# Altium project 24V Multiphase Buck.PrjPcb
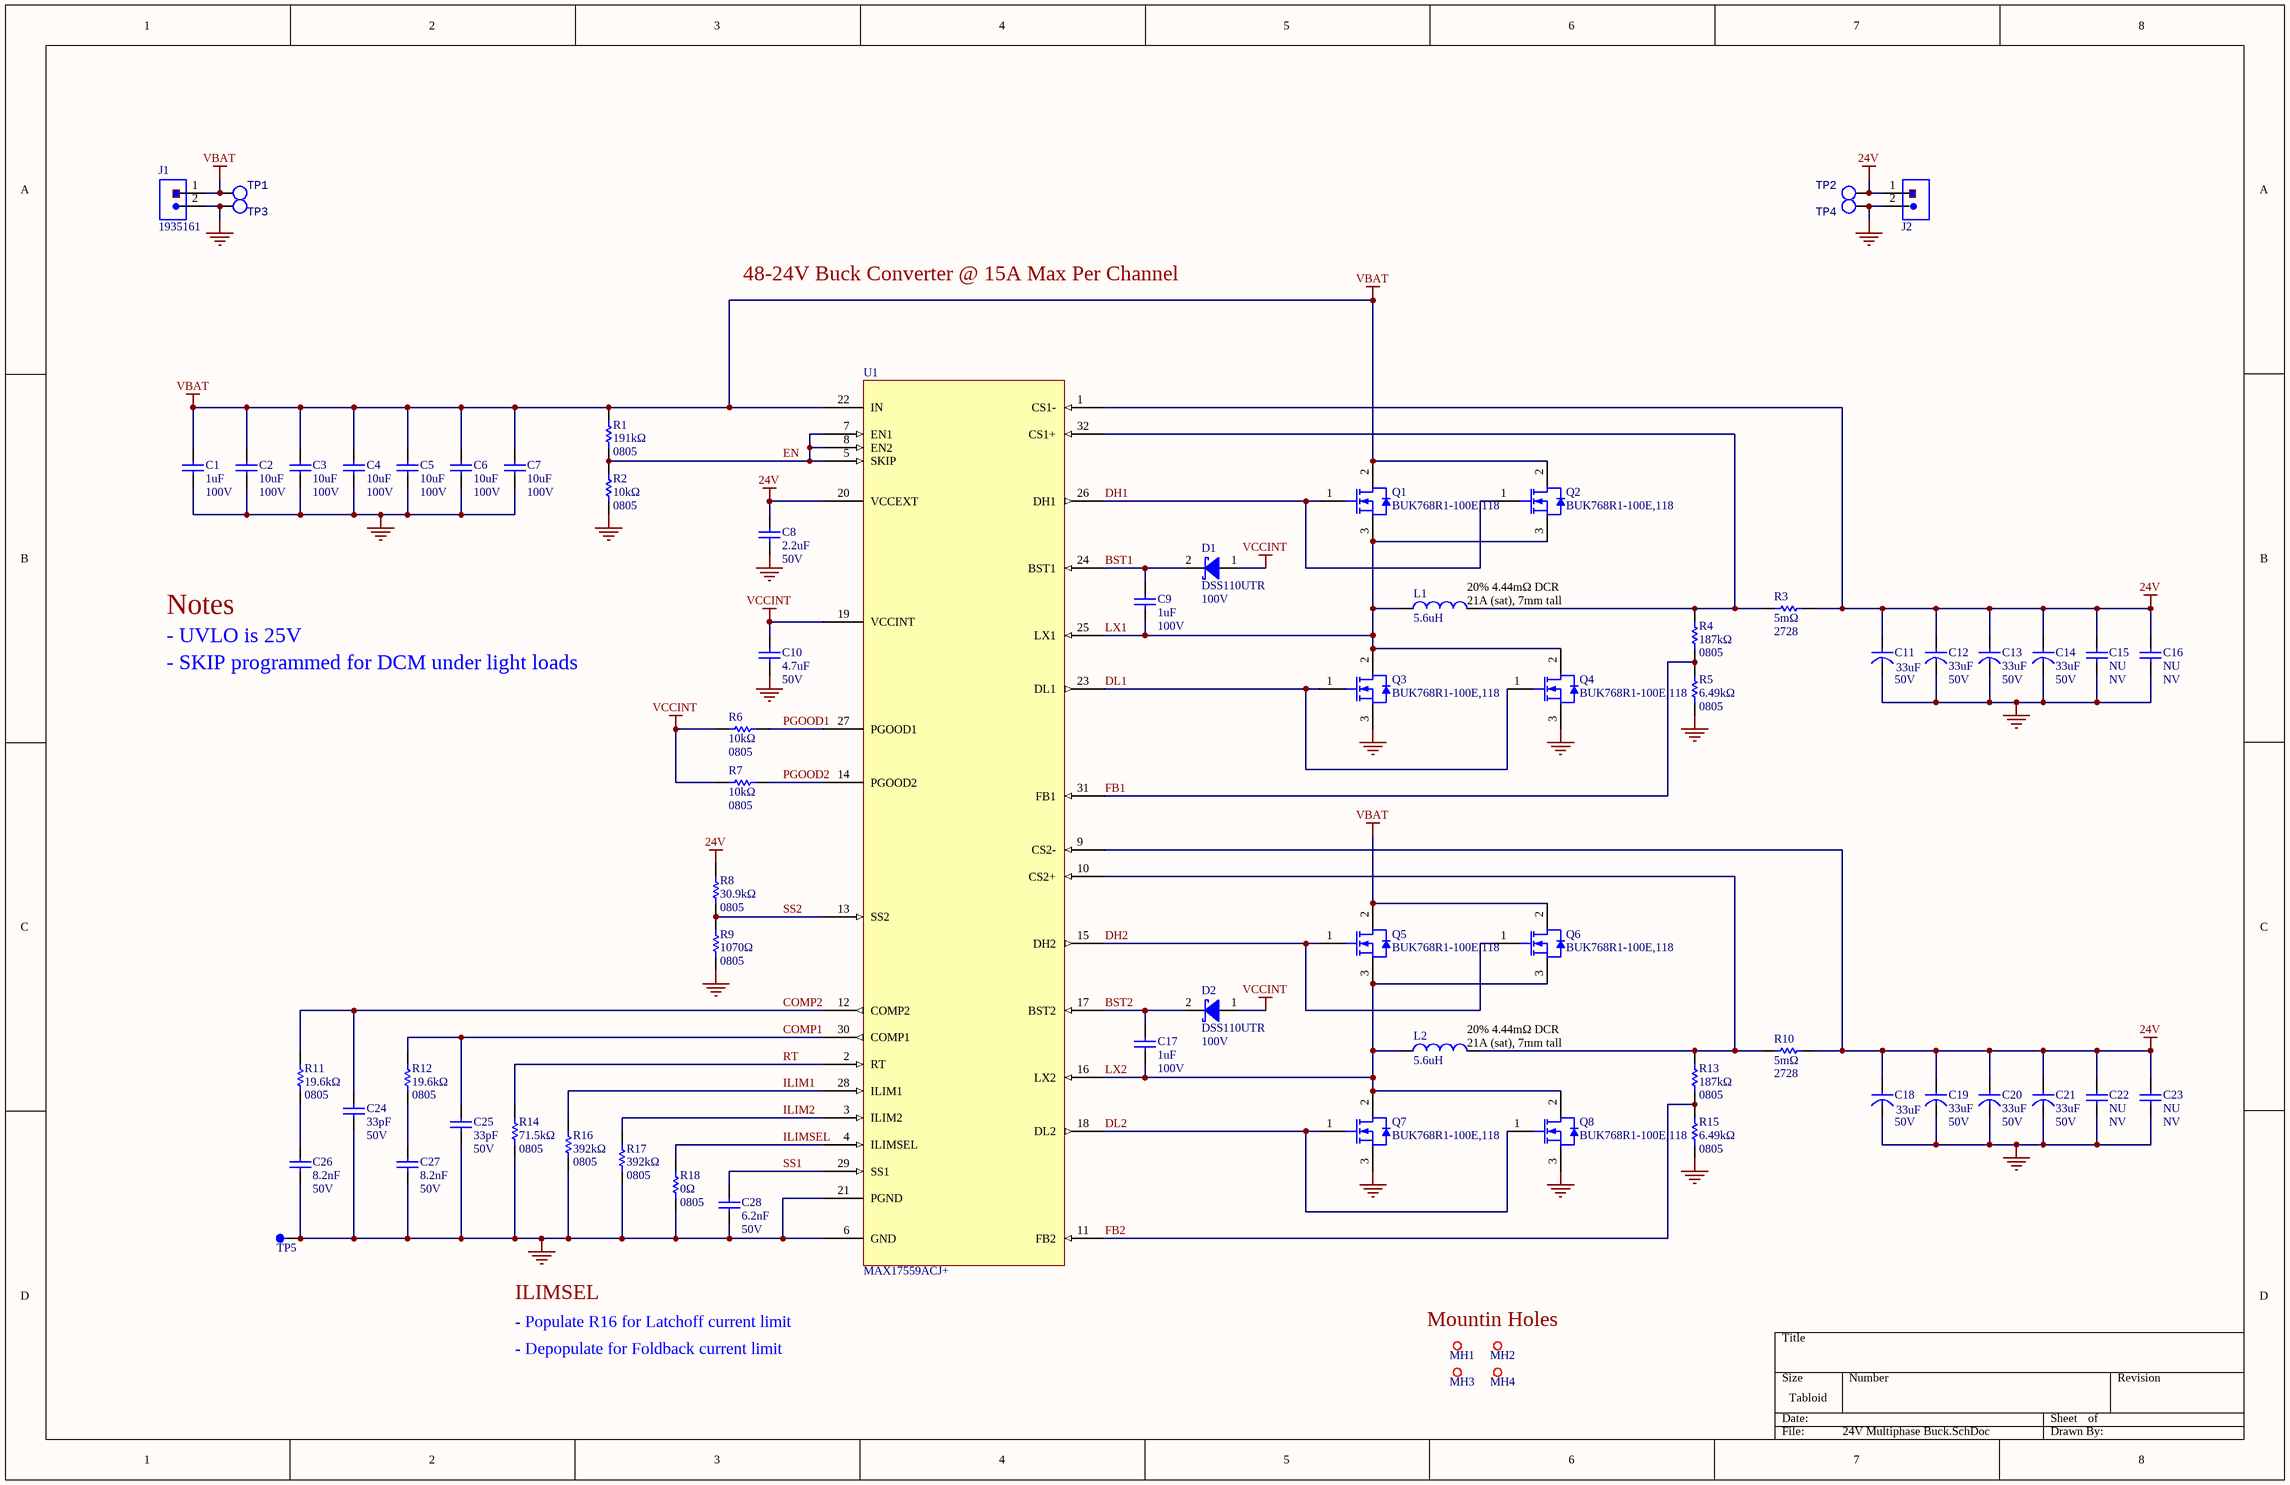
[diagram p0: 24V Multiphase Buck.SchDoc]
EMR_Address: 420 Downsview Pl, Waterloo, ON,  N2K3T9, Canada; EMR_Checked_By: T. Smouter; EMR_Copyright_Year: 2021; EMR_Customer: Internal; EMR_Drawn_By: T. Smouter; EMR_Project_Engineer: T. Smouter; EMR_Project_Title: Pipe Dream; EMR_Revision: 0.1
1 sheet, 70 parts. Net scope: global (net labels, ports and power ports of the same name join across sheets).
Board file: 24V Multiphase Buck.PcbDoc

## Sheet 24V Multiphase Buck.SchDoc
size Tabloid

### Parts
C1  value 1uF  Voltage: 100V  [C1206]  (hidden comment: Ceramic Cap)
C2  value 10uF  Voltage: 100V  [C2220]  (hidden comment: Ceramic Cap)
C3  value 10uF  Voltage: 100V  [C2220]  (hidden comment: Ceramic Cap)
C4  value 10uF  Voltage: 100V  [C2220]  (hidden comment: Ceramic Cap)
C5  value 10uF  Voltage: 100V  [C2220]  (hidden comment: Ceramic Cap)
C6  value 10uF  Voltage: 100V  [C2220]  (hidden comment: Ceramic Cap)
C7  value 10uF  Voltage: 100V  [C2220]  (hidden comment: Ceramic Cap)
C8  value 2.2uF  Voltage: 50V  [C0805]  (hidden comment: Ceramic Cap)
C9  value 1uF  Voltage: 100V  [C1206]  (hidden comment: Ceramic Cap)
C10  value 4.7uF  Voltage: 50V  [C0805]  (hidden comment: Ceramic Cap)
C11  value 33uF  Voltage: 50V  [CAPAE9983X105M]  (hidden comment: Electro Cap)
C12  value 33uF  Voltage: 50V  [CAPAE9983X105M]  (hidden comment: Electro Cap)
C13  value 33uF  Voltage: 50V  [CAPAE9983X105M]  (hidden comment: Electro Cap)
C14  value 33uF  Voltage: 50V  [CAPAE9983X105M]  (hidden comment: Electro Cap)
C15  value NU  Voltage: NV  [CAPC6153X67N]  (hidden comment: Ceramic Cap)
C16  value NU  Voltage: NV  [CAPC6153X67N]  (hidden comment: Ceramic Cap)
C17  value 1uF  Voltage: 100V  [C1206]  (hidden comment: Ceramic Cap)
C18  value 33uF  Voltage: 50V  [CAPAE9983X105M]  (hidden comment: Electro Cap)
C19  value 33uF  Voltage: 50V  [CAPAE9983X105M]  (hidden comment: Electro Cap)
C20  value 33uF  Voltage: 50V  [CAPAE9983X105M]  (hidden comment: Electro Cap)
C21  value 33uF  Voltage: 50V  [CAPAE9983X105M]  (hidden comment: Electro Cap)
C22  value NU  Voltage: NV  [CAPC6153X67N]  (hidden comment: Ceramic Cap)
C23  value NU  Voltage: NV  [CAPC6153X67N]  (hidden comment: Ceramic Cap)
C24  value 33pF  Voltage: 50V  [C0805]  (hidden comment: Ceramic Cap)
C25  value 33pF  Voltage: 50V  [C0805]  (hidden comment: Ceramic Cap)
C26  value 8.2nF  Voltage: 50V  [C0805]  (hidden comment: Ceramic Cap)
C27  value 8.2nF  Voltage: 50V  [C0805]  (hidden comment: Ceramic Cap)
C28  value 6.2nF  Voltage: 50V  [C0805]  (hidden comment: Ceramic Cap)
D1  Manufacturer Part Number: DSS110UTR  Vr: 100V  [SODFL360X110-2N]  (hidden comment: Schottky Diode)
D2  Manufacturer Part Number: DSS110UTR  Vr: 100V  [SODFL360X110-2N]  (hidden comment: Schottky Diode)
J1  1935161  [1935161]
J2  1935161  [1935161]  (value not drawn)
L1  value 5.6uH  [IHLP6767GZER5R6M11]  (hidden comment: Inductor)
L2  value 5.6uH  [IHLP6767GZER5R6M11]  (hidden comment: Inductor)
MH1  MOUNTING_HOLE_M3  [MOUNTING_HOLE_3mm]  (value not drawn)  (no BOM)
MH2  MOUNTING_HOLE_M3  [MOUNTING_HOLE_3mm]  (value not drawn)  (no BOM)
MH3  MOUNTING_HOLE_M3  [MOUNTING_HOLE_3mm]  (value not drawn)  (no BOM)
MH4  MOUNTING_HOLE_M3  [MOUNTING_HOLE_3mm]  (value not drawn)  (no BOM)
Q1  BUK768R1-100E,118  [DPAK254P1530X450-3N]
Q2  BUK768R1-100E,118  [DPAK254P1530X450-3N]
Q3  BUK768R1-100E,118  [DPAK254P1530X450-3N]
Q4  BUK768R1-100E,118  [DPAK254P1530X450-3N]
Q5  BUK768R1-100E,118  [DPAK254P1530X450-3N]
Q6  BUK768R1-100E,118  [DPAK254P1530X450-3N]
Q7  BUK768R1-100E,118  [DPAK254P1530X450-3N]
Q8  BUK768R1-100E,118  [DPAK254P1530X450-3N]
R1  value 191kΩ  Package/Footprint: 0805  [R0805]  (hidden comment: Resistor)
R2  value 10kΩ  Package/Footprint: 0805  [R0805]  (hidden comment: Resistor)
R3  value 5mΩ  Package/Footprint: 2728  [R2728]  (hidden comment: Resistor)
R4  value 187kΩ  Package/Footprint: 0805  [R0805]  (hidden comment: Resistor)
R5  value 6.49kΩ  Package/Footprint: 0805  [R0805]  (hidden comment: Resistor)
R6  value 10kΩ  Package/Footprint: 0805  [R0805]  (hidden comment: Resistor)
R7  value 10kΩ  Package/Footprint: 0805  [R0805]  (hidden comment: Resistor)
R8  value 30.9kΩ  Package/Footprint: 0805  [R0805]  (hidden comment: Resistor)
R9  value 1070Ω  Package/Footprint: 0805  [R0805]  (hidden comment: Resistor)
R10  value 5mΩ  Package/Footprint: 2728  [R2728]  (hidden comment: Resistor)
R11  value 19.6kΩ  Package/Footprint: 0805  [R0805]  (hidden comment: Resistor)
R12  value 19.6kΩ  Package/Footprint: 0805  [R0805]  (hidden comment: Resistor)
R13  value 187kΩ  Package/Footprint: 0805  [R0805]  (hidden comment: Resistor)
R14  value 71.5kΩ  Package/Footprint: 0805  [R0805]  (hidden comment: Resistor)
R15  value 6.49kΩ  Package/Footprint: 0805  [R0805]  (hidden comment: Resistor)
R16  value 392kΩ  Package/Footprint: 0805  [R0805]  (hidden comment: Resistor)
R17  value 392kΩ  Package/Footprint: 0805  [R0805]  (hidden comment: Resistor)
R18  value 0Ω  Package/Footprint: 0805  [R0805]  (hidden comment: Resistor)
TP1  TESTPOINT_LOOP  [TESTPOINT_LOOP]  (value not drawn)
TP2  TESTPOINT_LOOP  [TESTPOINT_LOOP]  (value not drawn)
TP3  TESTPOINT_LOOP  [TESTPOINT_LOOP]  (value not drawn)
TP4  TESTPOINT_LOOP  [TESTPOINT_LOOP]  (value not drawn)
TP5  EMR_TP  [TP1]  (value not drawn)
U1  MAX17559ACJ+  [CQFP80P900X900X120-32N]

### Nets
24V: C8.2 C11.1(+) C12.1(+) C13.1(+) C14.1(+) C15.2 C16.2 C18.1(+) C19.1(+) C20.1(+) C21.1(+) C22.2 C23.2 J2.1 R3.2 R8.2 R10.2 TP2.1 U1.1(CS1-) U1.9(CS2-) U1.20(VCCEXT)
GND: C1.1 C2.1 C3.1 C4.1 C5.1 C6.1 C7.1 C8.1 C10.1 C11.2(-) C12.2(-) C13.2(-) C14.2(-) C15.1 C16.1 C18.2(-) C19.2(-) C20.2(-) C21.2(-) C22.1 C23.1 C24.1 C25.1 C26.1 C27.1 C28.1 J1.2 J2.2 Q3.3(S) Q4.3(S) Q7.3(S) Q8.3(S) R2.1 R5.1 R9.1 R14.1 R15.1 R16.1 R17.1 R18.1 TP3.1 TP4.1 TP5.1(A) U1.6(GND) U1.21(PGND)
VBAT: C1.2 C2.2 C3.2 C4.2 C5.2 C6.2 C7.2 J1.1 Q1.2(D) Q2.2(D) Q5.2(D) Q6.2(D) R1.2 TP1.1 U1.22(IN)
VCCINT: C10.2 D1.1(A) D2.1(A) R6.1 R7.1 U1.19(VCCINT)
BST1: C9.2 D1.2(K) U1.24(BST1)
BST2: C17.2 D2.2(K) U1.17(BST2)
COMP1: C25.2 R12.2 U1.30(COMP1)
COMP2: C24.2 R11.2 U1.12(COMP2)
DH1: Q1.1(G) Q2.1(G) U1.26(DH1)
DH2: Q5.1(G) Q6.1(G) U1.15(DH2)
DL1: Q3.1(G) Q4.1(G) U1.23(DL1)
DL2: Q7.1(G) Q8.1(G) U1.18(DL2)
EN: R1.1 R2.2 U1.5(SKIP) U1.7(EN1) U1.8(EN2)
FB1: R4.1 R5.2 U1.31(FB1)
FB2: R13.1 R15.2 U1.11(FB2)
ILIM1: R16.2 U1.28(ILIM1)
ILIM2: R17.2 U1.3(ILIM2)
ILIMSEL: R18.2 U1.4(ILIMSEL)
LX1: C9.1 L1.1 Q1.3(S) Q2.3(S) Q3.2(D) Q4.2(D) U1.25(LX1)
LX2: C17.1 L2.1 Q5.3(S) Q6.3(S) Q7.2(D) Q8.2(D) U1.16(LX2)
PGOOD1: R6.2 U1.27(PGOOD1)
PGOOD2: R7.2 U1.14(PGOOD2)
RT: R14.2 U1.2(RT)
SS1: C28.2 U1.29(SS1)
SS2: R8.1 R9.2 U1.13(SS2)
NetC26_2: C26.2 R11.1
NetC27_2: C27.2 R12.1
NetL1_2: L1.2 R3.1 R4.2 U1.32(CS1+)
NetL2_2: L2.2 R10.1 R13.2 U1.10(CS2+)

### Notes on the sheet
- 48-24V Buck Converter @ 15A Max Per Channel
- Notes
- (near L1) 20% 4.44mΩ DCR
- (near L1) 21A (sat), 7mm tall
- - SKIP programmed for DCM under light loads
- - UVLO is 25V
- (near L2) 20% 4.44mΩ DCR
- (near L2) 21A (sat), 7mm tall
- ILIMSEL
- - Populate R16 for Latchoff current limit
- - Depopulate for Foldback current limit
- Mountin Holes

### Library data of the parts
C1 C9 C17 = CL31B105KCHNFNE: Manufacturer: Samsung Electro-Mechanics; Part Number: CL31B105KCHNFNE; Package: 1206; Supplier: Digi-Key; Supplier Part Number: 1276-3094-2-ND; Voltage Rating: 100V; Capacitance: 1uF
C2-C7 = 22201C106KAT2A: Manufacturer: KYOCERA AVX; Part Number: 22201C106KAT2A; Package: 2220; Supplier: Digi-Key; Supplier Part Number: 478-12492-1-ND; Voltage Rating: 100V; Capacitance: 10uF
C8 = CL21A225KBFNNNE: Manufacturer: Samsung Electro-Mechanics; Part Number: CL21A225KBFNNNE; Package: 0805; Supplier: Digi-Key; Supplier Part Number: 1276-6702-1-ND; Voltage Rating: 50V; Capacitance: 2.2uF
C10 = GRM21BR61H475KE51L: Manufacturer: Murata Electronics; Part Number: GRM21BR61H475KE51L; Package: 0805; Supplier: Digi-Key; Supplier Part Number: 490-10751-1-ND; Voltage Rating: 50V; Capacitance: 4.7uF
C11-C14 C18-C21 = EEV-FC1H330P: Manufacturer: Panasonic Electronic Components; Part Number: EEV-FC1H330P; Package: Radial; Supplier: Digi-Key; Supplier Part Number: PCE3258CT-ND; Voltage Rating: 50V; Capacitance: 33uF
C15 C16 C22 C23 = KRM55WR71H336MH01K: Manufacturer: Murata Electronics; Part Number: KRM55WR71H336MH01K; Package: Stacked SMD; Supplier: Digi-Key; Supplier Part Number: 490-17695-1-ND; Voltage Rating: NV; Capacitance: NU
C24 C25 = C0805C330K5GAC7800: Manufacturer: KEMET; Part Number: C0805C330K5GAC7800; Package: 0805; Supplier: Digi-Key; Supplier Part Number: 339-C0805C330K5GAC7800CT-ND; Voltage Rating: 50V; Capacitance: 33pF
C26 C27 = CC0805KRX7R9BB822: Manufacturer: YAGEO; Part Number: CC0805KRX7R9BB822; Package: 0805; Supplier: Digi-Key; Supplier Part Number: 311-4331-1-ND; Voltage Rating: 50V; Capacitance: 8.2nF
C28 = GRM2195C1H622JA01D: Manufacturer: Murata Electronics; Part Number: GRM2195C1H622JA01D; Package: 0805; Supplier: Digi-Key; Supplier Part Number: 490-1637-1-ND; Voltage Rating: 50V; Capacitance: 6.2nF
D1 D2 = DSS110UTR: Part Number: DSS110UTR; Package: SOD-123F; Supplier: Digi-Key; Supplier Part Number: 1655-1931-1-ND; Vr (Max): 100V
J1 = 1935161: 2 Port Terminal; Manufacturer: Phoenix Contact; Part Number: 1935161; Mounting Type: TH; Supplier: Digi-Key; Supplier Part Number: 277-1667-ND
J2 = 1935161: Manufacturer: Phoenix Contact; Part Number: 1935161; Mounting Type: TH; Supplier: Digi-Key; Supplier Part Number: 277-1667-ND
L1 L2 = IHLP6767GZER5R6M11: Manufacturer: Vishay Dale; DCR: 4.44mΩ; Tolerance: 20%; Saturation Current: 21A; Part Number: IHLP6767GZER5R6M11; Inductance: 5.6uH; Supplier: Digi-Key; Supplier Part Number: 541-1283-1-ND
Q1-Q8 = BUK768R1-100E,118: Manufacturer: Nexperia USA Inc.; Type: N-CH; Vds: 100V; Vgs (Max): 20V; Id: 100A; Manufacturer Part Number: BUK768R1-100E,118; Part Number: BUK768R1-100E,118; Package: D2PAK; Supplier: Digi-Key; Supplier Part Number: 1727-1062-1-ND
R1 = RC0805FR-07191KL: Manufacturer: Yageo; Part Number: RC0805FR-07191KL; Supplier: Digi-Key; Supplier Part Number: 311-191KCRTR-ND; Resistance: 191kΩ; Package: 0805
R2 R6 R7 = RC0805JR-0710KL: Manufacturer: Yageo; Part Number: RC0805JR-0710KL; Supplier: Digi-Key; Supplier Part Number: 311-10KARTR-ND; Resistance: 10kΩ; Package: 0805
R3 R10 = CSSH2728FT5L00: Manufacturer: Yageo; Part Number: CSSH2728FT5L00; Supplier: Digi-Key; Supplier Part Number: CSSH2728FT5L00TR-ND; Resistance: 5mΩ; Package: 2728
R4 R13 = RT0805BRD07187KL: Manufacturer: Yageo; Part Number: RT0805BRD07187KL; Supplier: Digi-Key; Supplier Part Number: 13-RT0805BRD07187KLCT-ND; Resistance: 187kΩ; Package: 0805
R5 R15 = RC0805FR-076K49L: Manufacturer: Yageo; Part Number: RC0805FR-076K49L; Supplier: Digi-Key; Supplier Part Number: 311-6.49KCRTR-ND; Resistance: 6.49kΩ; Package: 0805
R8 = RMCF0805FT30K9: Manufacturer: Stackpole Electronics Inc; Part Number: RMCF0805FT30K9; Supplier: Digi-Key; Supplier Part Number: RMCF0805FT30K9CT-ND; Resistance: 30.9kΩ; Package: 0805
R9 = RC0805FR-071K07L: Manufacturer: Yageo; Part Number: RC0805FR-071K07L; Supplier: Digi-Key; Supplier Part Number: 311-1.07KCRCT-ND; Resistance: 1070Ω; Package: 0805
R11 R12 = AC0805FR-0719K6L: Manufacturer: Yageo; Part Number: AC0805FR-0719K6L; Supplier: Digi-Key; Supplier Part Number: YAG5355TR-ND; Resistance: 19.6kΩ; Package: 0805
R14 = RC0805FR-0771K5L: Manufacturer: Yageo; Part Number: RC0805FR-0771K5L; Supplier: Digi-Key; Supplier Part Number: 311-71.5KCRCT-ND; Resistance: 71.5kΩ; Package: 0805
R16 R17 = RC0805FR-07392KL: Manufacturer: Yageo; Part Number: RC0805FR-07392KL; Supplier: Digi-Key; Supplier Part Number: 311-392KCRCT-ND; Resistance: 392kΩ; Package: 0805
R18 = RC0805JR-070RL: Manufacturer: Yageo; Part Number: RC0805JR-070RL; Supplier: Digi-Key; Supplier Part Number: 311-0.0ARCT-ND; Resistance: 0Ω; Package: 0805
TP1-TP4 = TESTPOINT_LOOP: TESTPOINT THRUHOLE; Manufacturer 1: Keystone Electronics; Manufacturer Part Number 1: 5002; Package/Footprint: TH; Supplier Part Number 1: 36-5002-ND; Supplier 1: Digi-Key; Mounting Type: TH
U1 = MAX17559ACJ+: IC REG CTRLR BUCK 32TQFP; Manufacturer: Maxim; Number of Outputs: 2; Part Number: MAX17559ACJ+; Supplier 1: Digi-Key; Supplier Part Number 1: MAX17559ACJ+-ND; Manufacturer Part Number: MAX17559ACJ+; RoHS: Yes; Stock 1: 210; Pricing 1: 1=7.47000, 10=6.75100, 25=6.43680, 80=5.58925, 250=5.33800, 500=4.86700, 1000=4.71000 (USD); Category: Voltage Regulators - Switching; Number of Pins: 32; Min Operating Temperature: -40°C; Max Operating Temperature: 125°C; Packaging: Tray; Case/Package: TQFP
TP5 = EMR_TP: Part Number: EMR_TP

## Assembly variants
01: all parts fitted